# Altium schematic sheet P1.schdoc
size 297 x 209 mm; Symbol: Drawing-Symbol_A4; @Project Name: 2.54_2x10; @Page Count: 1; @Update Date: 2026-08-08; @Create Date: 2026-08-08; @Schematic Name: Schematic1; @Page No: 1; @Page Name: P1; Company: EasyEDA.com; Version: V1.0; Page Size: A4; Device: Drawing-Symbol_A4; @Create Time: 16:08:17; @Update Time: 16:08:17; Border: 1; Width: 1170; Height: 825; Region Start: 1; X Region Count: 6; Y Region Count: 4; Blade Width: 10; Title Block Position: 3; @Board Name: Board1
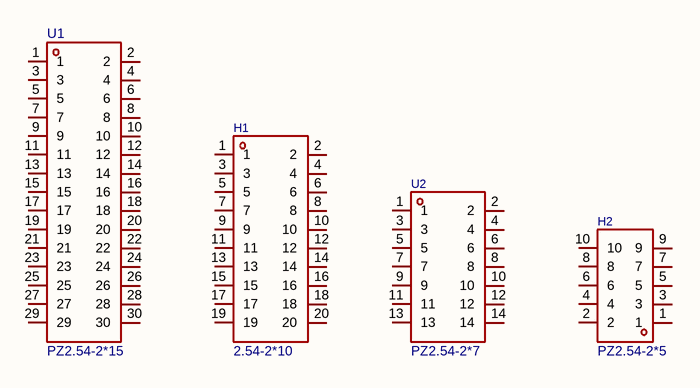
[diagram p0: P1.schdoc]

## Parts
H1  2.54-2*10  [HDR-TH_20P-P2.54-V-M-R2-C10-S2.54]
H2  PZ2.54-2*5  [HDR-TH_10P-P2.54-V-M-R2-C5-S2.54-1]
U1  PZ2.54-2*15  [HDR-TH_30P-P2.54-V-M-R2-C15-S2.54-2]
U2  PZ2.54-2*7  [HDR-TH_14P-P2.54-V-M-R2-C7-S2.54-1]

## Nets

Not connected (* = marked no-connect by the designer): H1 1 2 3 4 5 6 7 8 9 10 11 12 13 14 15 16 17 18 19 20; H2 1 2 3 4 5 6 7 8 9 10; U1 1 2 3 4 5 6 7 8 9 10 11 12 13 14 15 16 17 18 19 20 21 22 23 24 25 26 27 28 29 30; U2 1 2 3 4 5 6 7 8 9 10 11 12 13 14

## Notes on the sheet
- Create at
- 2026-08-08
- Schematic
- Board
- Schematic1
- Board1
- Update at
- Page
- P1
- Drawn
- Reviewed
- 2.54_2x10
- Version
- V1.0
- Size
- A4
- Page  1  Total  1
- EasyEDA.com

## Library data of the parts
H1 = 2.54-2*10: Pin Structure:2x10P Pitch:2.54mm Row Spacing:2.54mm Circluar Pins/Square Pins:Pin Header Mounting Type:Through Hole Number of Rows:2 Number of Pins:20P Current Rating:2.5A Length of Mating Pin:6mm Insulation Height:2.54mm Length of End Connection Pin:3mm; Manufacturer: ZHOURI(洲日); AddInBom: yes; ModelId: 7b46918fe38e4962af531f5fab9490b00819f05c4eef4c71ace90d822a990e87; ModelName: HDR-TH_20P-P2.54-V-M-R2-C10-S2.54-1; ModelTransform: 1000.3917,199.9996,0,0,0,0,0,0,-118.11; Pin Structure: 2x10P; Pitch: 2.54mm; Current Rating: 2.5A; Symbol: 2.54-2*10; Device: 2.54-2*10; Supplier: LCSC; Supplier Part: C5116480; Manufacturer Part: 2.54-2*10; JLCPCB Part Class: Extended Part; LCSC Part Name: 2x10P 间距:2.54mm 方针 直插; Supplier Footprint: 插件,P=2.54mm; Datasheet: https://item.szlcsc.com/datasheet/2.54-2*10/5692723.html; ConvertToPcb: yes; FootprintName: HDR-TH_20P-P2.54-V-M-R2-C10-S2.54; Row Spacing: 2.54mm; Circluar Pins/Square Pins: Pin Header; Mounting Type: Through Hole; Number of Rows: 2; Number of Pins: 20P; Length of Mating Pin: 6mm; Insulation Height: 2.54mm; Length of End Connection Pin: 3mm; Contact Material: Brass; Contact Plating: Gold; Operating Temperature: -40℃~+105℃
H2 = PZ2.54-2*5: Pin Structure:2x5P Pitch:2.54mm Row Spacing:2.54mm Circluar Pins/Square Pins:Pin Header Mounting Type:Through Hole Number of Rows:2 Number of Pins:10P Current Rating:2.5A Length of Mating Pin:6mm Insulation Height:2.54mm Length of End Connection Pin:3mm C; Manufacturer: ZHOURI(洲日); AddInBom: yes; ModelId: 3331c3365ac7443ebcf508130b63aeaa0819f05c4eef4c71ace90d822a990e87; ModelName: HDR2.54-M-LI-2X5P; ModelTransform: 499.999,200,0,0,0,0,0,0,-118.11; Pin Structure: 2x5P; Pitch: 2.54mm; Current Rating: 2.5A; Symbol: PZ2.54-2*5; Device: PZ2.54-2*5; Supplier: LCSC; Supplier Part: C5156677; Manufacturer Part: PZ2.54-2*5; JLCPCB Part Class: Extended Part; LCSC Part Name: 2x5P 间距:2.54mm 方针 直插; Supplier Footprint: 插件,P=2.54mm; Datasheet: https://item.szlcsc.com/datasheet/PZ2.54-2*5/5790846.html; ConvertToPcb: yes; FootprintName: HDR-TH_10P-P2.54-V-M-R2-C5-S2.54-1; Row Spacing: 2.54mm; Circluar Pins/Square Pins: Pin Header; Mounting Type: Through Hole; Number of Rows: 2; Number of Pins: 10P; Length of Mating Pin: 6mm; Insulation Height: 2.54mm; Length of End Connection Pin: 3mm; Contact Material: Brass; Contact Plating: Gold; Operating Temperature: -40℃~+105℃
U1 = PZ2.54-2*15: Pin Structure:2x15P Pitch:2.54mm Row Spacing:2.54mm Circluar Pins/Square Pins:Pin Header Mounting Type:Through Hole Number of Rows:2 Number of Pins:30P Current Rating:2.5A Length of Mating Pin:6mm Insulation Height:2.54mm Length of End Connection Pin:3mm; Manufacturer: ZHOURI(洲日); AddInBom: yes; ModelId: 20e3c55689c04fa0b6843741cd9657110819f05c4eef4c71ace90d822a990e87; ModelTransform: 1500.036,196.85,0,0,0,0,0,0,-118.11; Pin Structure: 2x15P; Pitch: 2.54mm; Current Rating: 2.5A; Symbol: PZ2.54-2*15; Device: PZ2.54-2*15; LCSC Part Name: 2x15P 间距:2.54mm 方针 直插; SupplierPart: C5224013; ManufacturerPart: PZ2.54-2*15; Supplier Footprint: 插件,P=2.54mm; JLCPCB Part Class: Extended Part; Datasheet: https://item.szlcsc.com/datasheet/PZ2.54-2*15/5925192.html; Supplier: LCSC; ConvertToPcb: yes; FootprintName: HDR-TH_30P-P2.54-V-M-R2-C15-S2.54-2; ModelName: HDR-TH_30P-P2.54-V-M-R2-C15-S2.54-2; Row Spacing: 2.54mm; Circluar Pins/Square Pins: Pin Header; Mounting Type: Through Hole; Number of Rows: 2; Number of Pins: 30P; Length of Mating Pin: 6mm; Insulation Height: 2.54mm; Length of End Connection Pin: 3mm; Contact Material: Brass; Contact Plating: Gold; Operating Temperature: -40℃~+105℃
U2 = PZ2.54-2*7: Pin Structure:2x7P Pitch:2.54mm Row Spacing:2.54mm Circluar Pins/Square Pins:Pin Header Mounting Type:Through Hole Number of Rows:2 Number of Pins:14P Current Rating:2.5A Length of Mating Pin:6mm Insulation Height:2.54mm Length of End Connection Pin:3mm C; Manufacturer: ZHOURI(洲日); AddInBom: yes; ModelId: 151825a91c7e446fb947889005d0ab0d0819f05c4eef4c71ace90d822a990e87; ModelName: HDR2.54-M-LI-2X7P; ModelTransform: 699.9986,200,0,0,0,0,0,0,-118.11; Pin Structure: 2x7P; Pitch: 2.54mm; Current Rating: 2.5A; Symbol: PZ2.54-2*7; Device: PZ2.54-2*7; Supplier: LCSC; Supplier Part: C5156678; Manufacturer Part: PZ2.54-2*7; JLCPCB Part Class: Extended Part; LCSC Part Name: 2x7P 间距:2.54mm 方针 直插; Supplier Footprint: 插件,P=2.54mm; Datasheet: https://item.szlcsc.com/datasheet/PZ2.54-2*7/5790847.html; ConvertToPcb: yes; FootprintName: HDR-TH_14P-P2.54-V-M-R2-C7-S2.54-1; Row Spacing: 2.54mm; Circluar Pins/Square Pins: Pin Header; Mounting Type: Through Hole; Number of Rows: 2; Number of Pins: 14P; Length of Mating Pin: 6mm; Insulation Height: 2.54mm; Length of End Connection Pin: 3mm; Contact Material: Brass; Contact Plating: Gold; Operating Temperature: -40℃~+105℃